# Altium schematic sheet PROGRAMMER.SchDoc
size A; DocumentNumber: 6; SheetNumber: 6; SheetTotal: 6
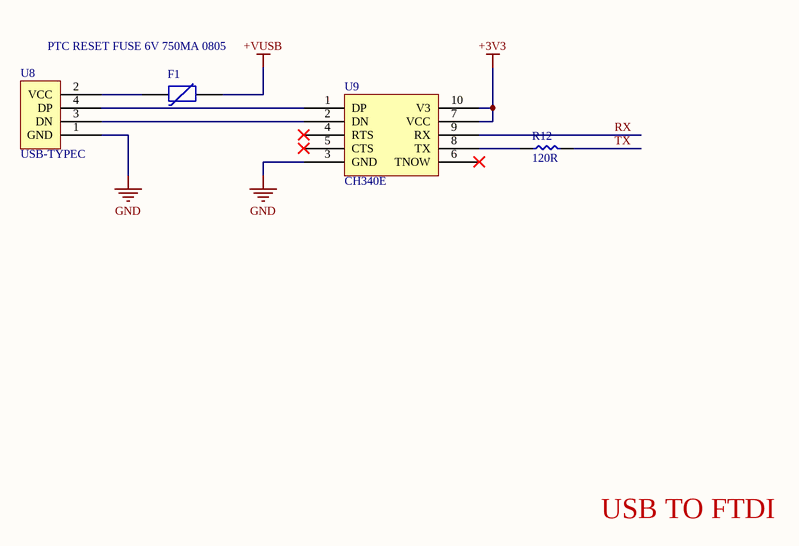
[diagram p0: PROGRAMMER.SchDoc]

## Parts
F1  PTC RESET FUSE 6V 750MA 0805  [F0805L075SL]
R12  120R  [R0603]
U8  USB-TYPEC  [USB-TYPEC]
U9  CH340E  [MSOP-10]

## Nets
+3V3: U9.7(VCC) U9.10(V3)
+VUSB: F1.2
GND: U8.1(GND) U9.3(GND)
RX: U9.9(RX)
TX: R12.2
NetF1_1: F1.1 U8.2(VCC)
NetR12_1: R12.1 U9.8(TX)
NetU8_3: U8.3(DN) U9.2(DN)
NetU8_4: U8.4(DP) U9.1(DP)

Not connected (* = marked no-connect by the designer): U9 4(RTS)* 5(CTS)* 6(TNOW)*

## Notes on the sheet
- USB TO FTDI

## Library data of the parts
F1 = 0805L075SLYR: Manufacturer: Littelfuse Inc.; Type: Polymeric; Approvals: cURus, TUV; Supplier 1: Digi-Key; Manufacturer Part Number: 0805L075SLYR; RoHS: RoHS Compliant; Category: Circuit Protection; Stock 1: 4000; Pricing 1: 4000=0.715, 8000=0.6875 (USD); Packaging: Tape & Reel (TR); Part Status: Active; Voltage - Max: 6V; Operating Temperature: -40°C ~ 85°C; Ratings: -; Mounting Type: Surface Mount; Package / Case: 0805 (2012 Metric), Concave; Size / Dimension: 0.083" L x 0.053" W (2.10mm x 1.35mm); Height - Seated (Max): -; Thickness (Max): 0.030" (0.75mm); Lead Spacing: -; ComponentLink1URL: http://www.littelfuse.com/~/media/electronics/datasheets/resettable_ptcs/littelfuse_ptc_lorho_datasheet.pdf.pdf; ComponentLink1Description: http://www.littelfuse.com/~/media/electronics/datasheets/resettable_ptcs/littelfuse_ptc_lorho_datasheet.pdf.pdf; Supplier Part Number 1: F4151TR-ND
R12 = ERA-3AEB121V: RESISTOR, 0603, 120R, FULL REEL; Manufacturer: Panasonic; Temperature Coefficient: ± 25ppm/°C; Voltage Rating: 75V; Product Range: PANASONIC - ERA Series; Resistance: 120ohm; Power Rating: 100mW; Resistance Tolerance: ± 0.1%; Resistor Case Style: 0603 ^1608 Metric]; Resistor Element Type: Thin Film; Supplier 1: Digi-Key; Manufacturer Part Number: ERA-3AEB121V; Stock 1: 198203; Pricing 1: 1=0.35, 10=0.3, 100=0.1173, 1000=0.0491, 2500=0.045 (USD); Packaging: Full Reel; ComponentLink1URL: http://www.farnell.com/datasheets/1776116.pdf?src-supplier=Element14; ComponentLink1Description: http://www.farnell.com/datasheets/1776116.pdf?src-supplier=Element14; ComponentLink2URL: https://www.distrelec.biz/Web/Downloads/_t/ds/ERA_eng_tds.pdf?mime=application%2Fpdf&src-supplier=Distrelec; ComponentLink2Description: https://www.distrelec.biz/Web/Downloads/_t/ds/ERA_eng_tds.pdf?mime=application%2Fpdf&src-supplier=Distrelec; ComponentLink3URL: http://www.farnell.com/datasheets/485442.pdf?src-supplier=Farnell; ComponentLink3Description: http://www.farnell.com/datasheets/485442.pdf?src-supplier=Farnell; ComponentLink4URL: http://www.farnell.com/datasheets/2052875.pdf?src-supplier=Farnell; ComponentLink4Description: http://www.farnell.com/datasheets/2052875.pdf?src-supplier=Farnell; ComponentLink5URL: http://www.farnell.com/datasheets/2059650.pdf?src-supplier=Farnell; ComponentLink5Description: http://www.farnell.com/datasheets/2059650.pdf?src-supplier=Farnell; ComponentLink6URL: http://industrial.panasonic.com/www-data/pdf/AOA0000/AOA0000CE26.pdf?src-supplier=Avnet; ComponentLink6Description: http://industrial.panasonic.com/www-data/pdf/AOA0000/AOA0000CE26.pdf?src-supplier=Avnet; ComponentLink7URL: http://uk.rs-online.com/webdocs/0fe2/0900766b80fe20f7.pdf?src-supplier=RSComponents; ComponentLink7Description: http://uk.rs-online.com/webdocs/0fe2/0900766b80fe20f7.pdf?src-supplier=RSComponents; ComponentLink8URL: http://www.farnell.com/datasheets/485442.pdf?src-supplier=Element14; ComponentLink8Description: http://www.farnell.com/datasheets/485442.pdf?src-supplier=Element14; ComponentLink9URL: http://industrial.panasonic.com/www-data/pdf/AOA0000/AOA0000CE26.pdf?src-supplier=Avnet+Europe; ComponentLink9Description: http://industrial.panasonic.com/www-data/pdf/AOA0000/AOA0000CE26.pdf?src-supplier=Avnet+Europe; ComponentLink10URL: https://produktinfo.conrad.com/datenblaetter/450000-474999/450380-da-01-en-WIDERSTAND_0603_ERA.pdf?src-supplier=Conrad; ComponentLink10Description: https://produktinfo.conrad.com/datenblaetter/450000-474999/450380-da-01-en-WIDERSTAND_0603_ERA.pdf?src-supplier=Conrad; Supplier Part Number 1: P120DBCT-ND
U8 = USB4105-GF-A: Conn Rcpt USB2.0 Typec 5A; Manufacturer: Global Connector Technology; Supplier 1: Newark; Manufacturer Part Number: USB4105-GF-A; Stock 1: 0; Pricing 1: 1=1.69, 100=1.36, 250=1.23, 500=1.14, 1000=1.04 (USD); Supplier Part Number 1: 86AH2021
U9 = EMCH340: Manufacturer: Eaton; Manufacturer Part Number: EMCH340|EMCH340; Supplier 1: RSComponents; Stock 1: 0; Supplier Part Number 1: 1243048